# Altium project MiniPC.PrjPcb (part 1 of 2)
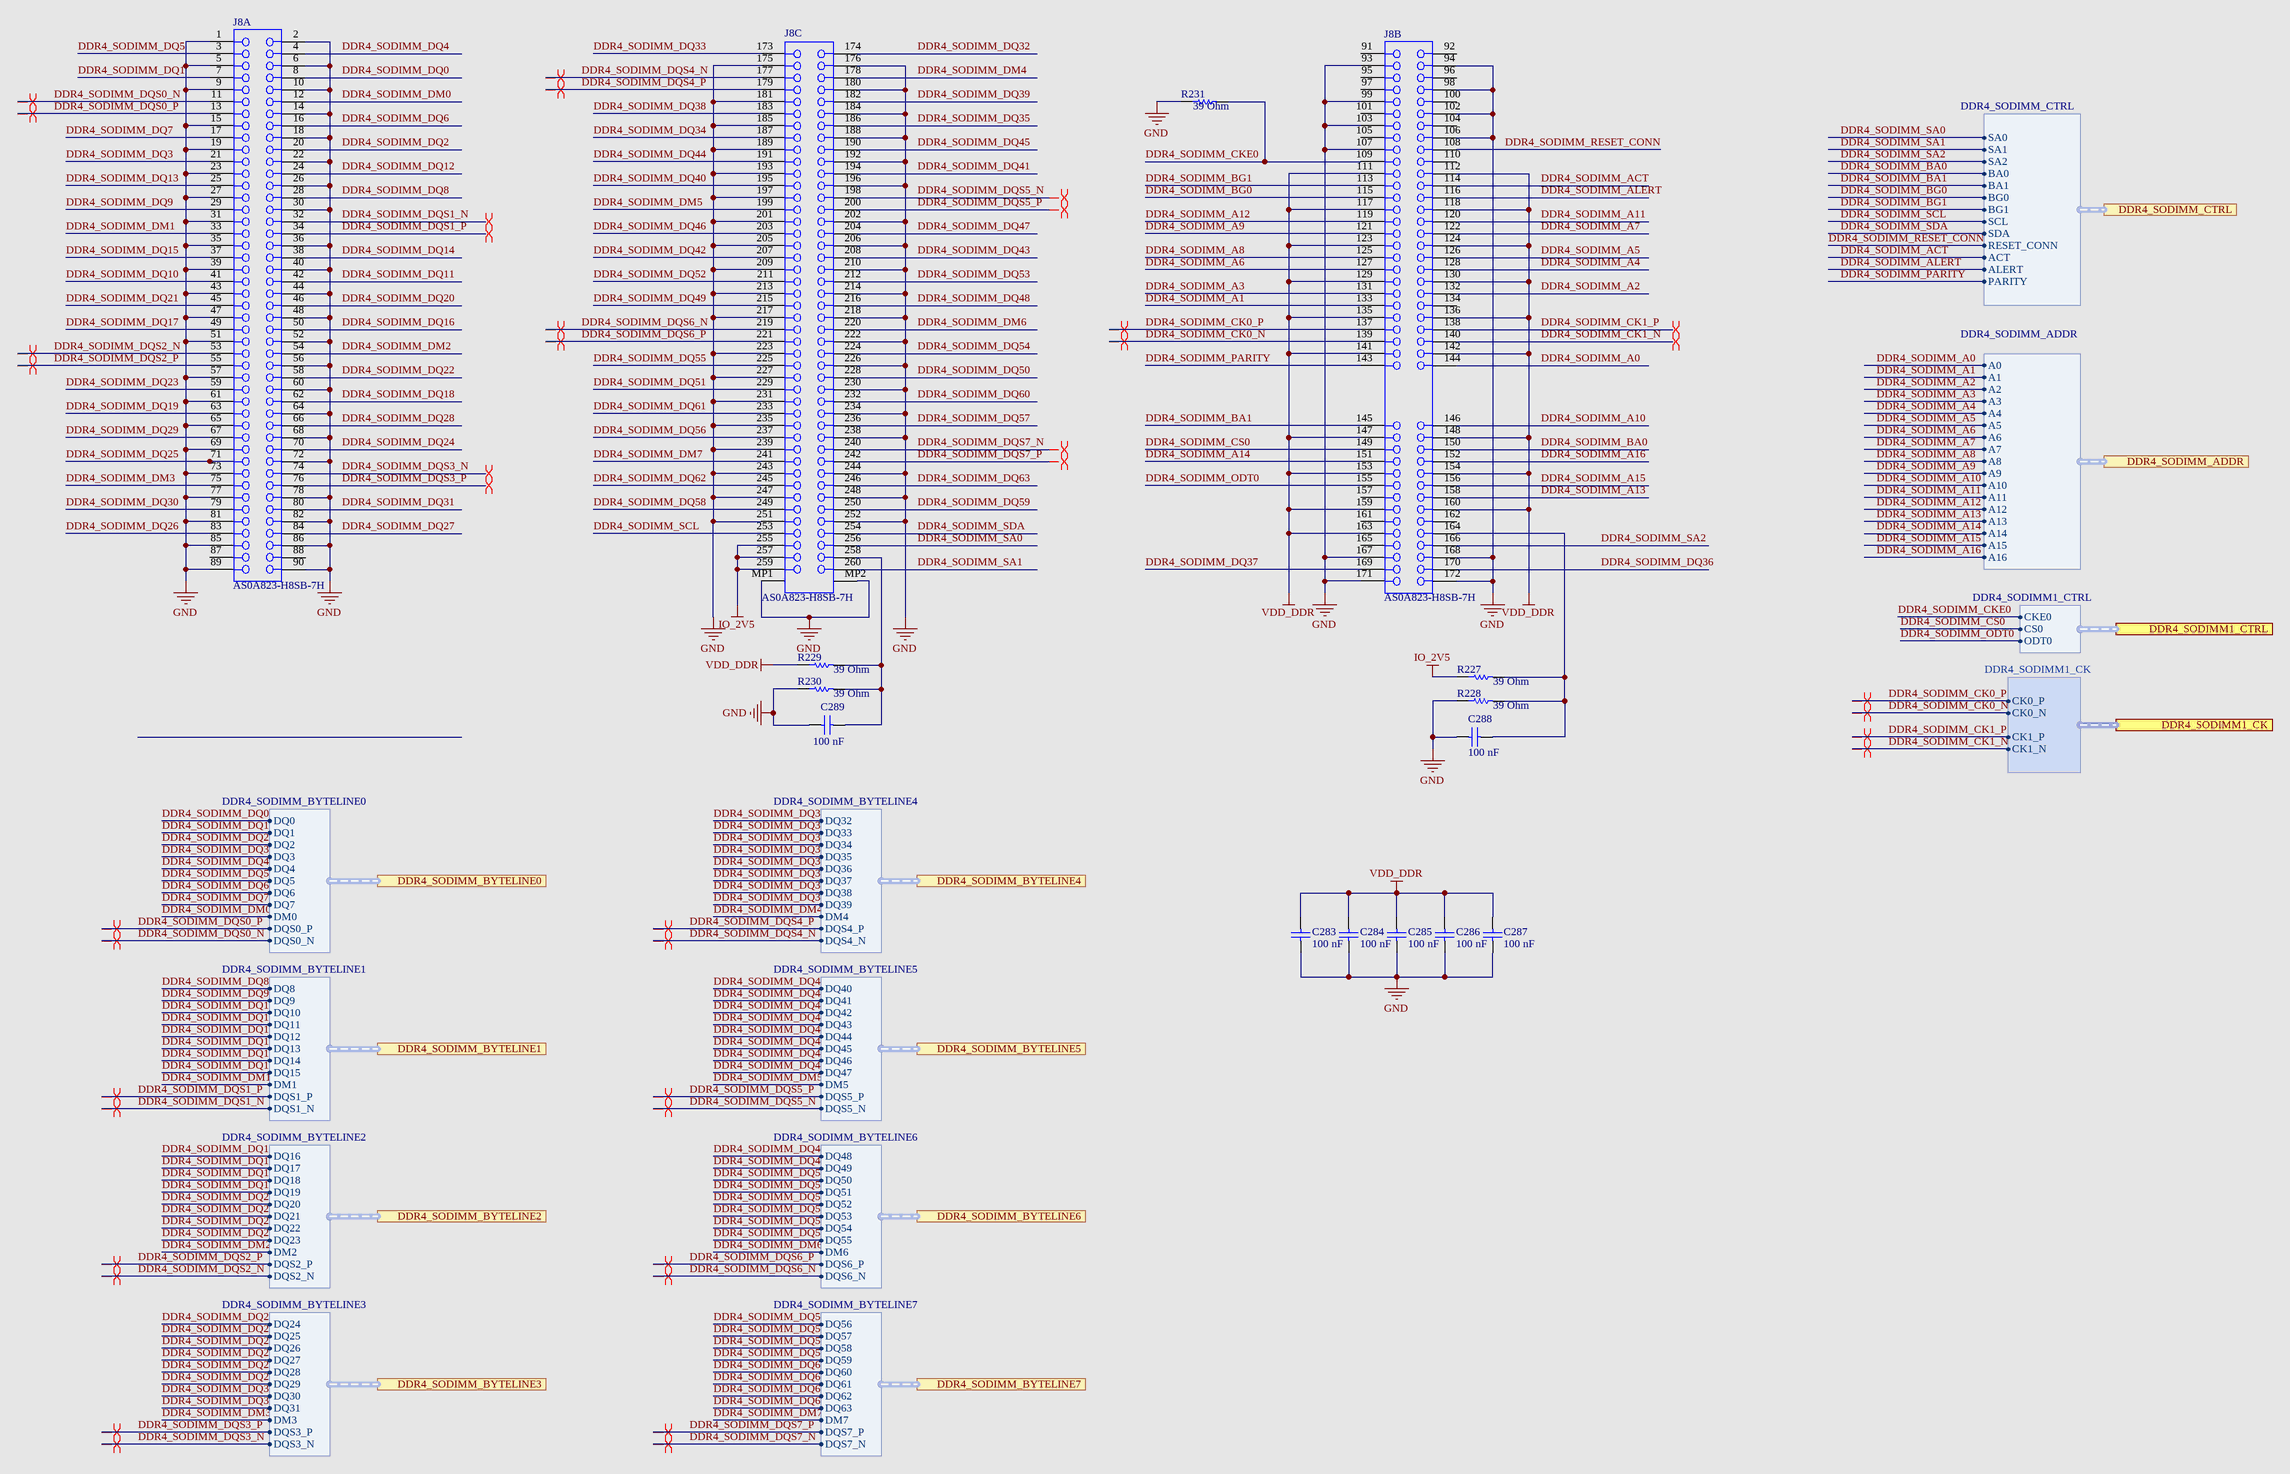
[diagram p0: DDR4_SODIMM1.SchDoc]
CompanyWebsite: www.altium.com; PrjAddress1: 4225 Executive Sqr; PrjAddress2: Suite 700; PrjAddress3: La Jolla, CA, USA; PrjAddress4: 92037; PrjCompanyName: Altium; Project: Mini PC Motherboard
4 sheets, 109 parts. Net scope: hierarchical (ports join the sheet entries above them; power ports are global).
Board file: MiniPC.PcbDoc
Sheets:
  DDR4_SODIMM1.SchDoc
  DDR4_SODIMM2.SchDoc
  Display_Port.SchDoc
  Ethernet2.SchDoc

## Sheet DDR4_SODIMM1.SchDoc: DDR4 SODIMM CONNECTOR1
size C; DocumentNumber: 3; SheetNumber: 3; SheetTotal: 46

### Parts
C283  Capacitance: 100 nF  [CAPC1005X55X10LL05]  (hidden comment: C1005X7R1E104M)
C284  Capacitance: 100 nF  [CAPC1005X55X10LL05]  (hidden comment: C1005X7R1E104M)
C285  Capacitance: 100 nF  [CAPC1005X55X10LL05]  (hidden comment: C1005X7R1E104M)
C286  Capacitance: 100 nF  [CAPC1005X55X10LL05]  (hidden comment: C1005X7R1E104M)
C287  Capacitance: 100 nF  [CAPC1005X55X10LL05]  (hidden comment: C1005X7R1E104M)
C288  Capacitance: 100 nF  [CAPC1005X55X10LL05]  (hidden comment: C1005X7R1E104M)
C289  Capacitance: 100 nF  [CAPC1005X55X10LL05]  (hidden comment: C1005X7R1E104M)
J8  AS0A823-H8SB-7H  [FOXC-AS0A823-H8SB-7H_V]  (parts A,B,C of 3)
R227  Resistance: 39 Ohm  [RESC1005X40X25NL5T10]  (hidden comment: RC0402JR-0739RL)
R228  Resistance: 39 Ohm  [RESC1005X40X25NL5T10]  (hidden comment: RC0402JR-0739RL)
R229  Resistance: 39 Ohm  [RESC1005X40X25NL5T10]  (hidden comment: RC0402JR-0739RL)
R230  Resistance: 39 Ohm  [RESC1005X40X25NL5T10]  (hidden comment: RC0402JR-0739RL)
R231  Resistance: 39 Ohm  [RESC1005X40X25NL5T10]  (hidden comment: RC0402JR-0739RL)

### Ports
DDR4_SODIMM1_CK (harness DDR4_SODIMM1_CK), DDR4_SODIMM1_CTRL (harness DDR4_SODIMM1_CTRL), DDR4_SODIMM_ADDR (harness DDR4_SODIMM_ADDR), DDR4_SODIMM_BYTELINE0 (harness DDR4_SODIMM_BYTELINE0), DDR4_SODIMM_BYTELINE1 (harness DDR4_SODIMM_BYTELINE1), DDR4_SODIMM_BYTELINE2 (harness DDR4_SODIMM_BYTELINE2), DDR4_SODIMM_BYTELINE3 (harness DDR4_SODIMM_BYTELINE3), DDR4_SODIMM_BYTELINE4 (harness DDR4_SODIMM_BYTELINE4), DDR4_SODIMM_BYTELINE5 (harness DDR4_SODIMM_BYTELINE5), DDR4_SODIMM_BYTELINE6 (harness DDR4_SODIMM_BYTELINE6), DDR4_SODIMM_BYTELINE7 (harness DDR4_SODIMM_BYTELINE7), DDR4_SODIMM_CTRL (harness DDR4_SODIMM_CTRL)

### Harnesses
DDR4_SODIMM_BYTELINE0: DQ0, DQ1, DQ2, DQ3, DQ4, DQ5, DQ6, DQ7, DM0, DQS0_P, DQS0_N
DDR4_SODIMM_BYTELINE1: DQ8, DQ9, DQ10, DQ11, DQ12, DQ13, DQ14, DQ15, DM1, DQS1_P, DQS1_N
DDR4_SODIMM_BYTELINE2: DQ16, DQ17, DQ18, DQ19, DQ20, DQ21, DQ22, DQ23, DM2, DQS2_P, DQS2_N
DDR4_SODIMM_BYTELINE3: DQ24, DQ25, DQ26, DQ27, DQ28, DQ29, DQ30, DQ31, DM3, DQS3_P, DQS3_N
DDR4_SODIMM_BYTELINE4: DQ32, DQ33, DQ34, DQ35, DQ36, DQ37, DQ38, DQ39, DM4, DQS4_P, DQS4_N
DDR4_SODIMM_BYTELINE5: DQ40, DQ41, DQ42, DQ43, DQ44, DQ45, DQ46, DQ47, DM5, DQS5_P, DQS5_N
DDR4_SODIMM_BYTELINE6: DQ48, DQ49, DQ50, DQ51, DQ52, DQ53, DQ54, DQ55, DM6, DQS6_P, DQS6_N
DDR4_SODIMM_BYTELINE7: DQ56, DQ57, DQ58, DQ59, DQ60, DQ61, DQ62, DQ63, DM7, DQS7_P, DQS7_N
DDR4_SODIMM_CTRL: SA0, SA1, SA2, BA0, BA1, BG0, BG1, SCL, SDA, RESET_CONN, ACT, ALERT, PARITY
DDR4_SODIMM1_CTRL: CKE0, CS0, ODT0
DDR4_SODIMM_ADDR: A0, A2, A1, A3, A4, A5, A6, A7, A9, A8, A10, A11, A12, A13, A14, A15, A16
DDR4_SODIMM1_CK: CK0_P, CK0_N, CK1_P, CK1_N

### Nets
GND: C283.1 C283.2 C284.1 C284.2 C285.1 C285.2 C286.1 C286.2 C287.1 C287.2 C288.1 C289.2 J8.1 J8.2 J8.5 J8.6 J8.9 J8.10 J8.14 J8.15 J8.18 J8.19 J8.22 J8.23 J8.26 J8.27 J8.30 J8.31 J8.35 J8.36 J8.39 J8.40 J8.43 J8.44 J8.47 J8.48 J8.51 J8.52 J8.56 J8.57 J8.60 J8.61 J8.64 J8.65 J8.68 J8.69 J8.72 J8.73 J8.77 J8.78 J8.81 J8.82 J8.85 J8.86 J8.89 J8.90 J8.93 J8.94 J8.98 J8.99 J8.102 J8.103 J8.106 J8.107 J8.111 J8.112 J8.117 J8.118 J8.123 J8.124 J8.129 J8.130 J8.135 J8.136 J8.141 J8.142 J8.147 J8.148 J8.153 J8.154 J8.159 J8.160 J8.163 J8.167 J8.168 J8.171 J8.172 J8.175 J8.176 J8.180 J8.181 J8.184 J8.185 J8.188 J8.189 J8.192 J8.193 J8.196 J8.197 J8.201 J8.202 J8.205 J8.206 J8.209 J8.210 J8.213 J8.214 J8.217 J8.218 J8.222 J8.223 J8.226 J8.227 J8.230 J8.231 J8.234 J8.235 J8.238 J8.239 J8.243 J8.244 J8.247 J8.248 J8.251 J8.252 J8.MP1 J8.MP2 R228.1 R229.1 R230.1 R231.1  [also labelled VDD_DDR]
IO_2V5: J8.255 J8.257 J8.259 R227.1
DDR4_SODIMM_A0: J8.144 ; port DDR4_SODIMM_ADDR.A0
DDR4_SODIMM_A1: J8.133 ; port DDR4_SODIMM_ADDR.A1
DDR4_SODIMM_A2: J8.132 ; port DDR4_SODIMM_ADDR.A2
DDR4_SODIMM_A3: J8.131 ; port DDR4_SODIMM_ADDR.A3
DDR4_SODIMM_A4: J8.128 ; port DDR4_SODIMM_ADDR.A4
DDR4_SODIMM_A5: J8.126 ; port DDR4_SODIMM_ADDR.A5
DDR4_SODIMM_A6: J8.127 ; port DDR4_SODIMM_ADDR.A6
DDR4_SODIMM_A7: J8.122 ; port DDR4_SODIMM_ADDR.A7
DDR4_SODIMM_A8: J8.125 ; port DDR4_SODIMM_ADDR.A8
DDR4_SODIMM_A9: J8.121 ; port DDR4_SODIMM_ADDR.A9
DDR4_SODIMM_A10: J8.146 ; port DDR4_SODIMM_ADDR.A10
DDR4_SODIMM_A11: J8.120 ; port DDR4_SODIMM_ADDR.A11
DDR4_SODIMM_A12: J8.119 ; port DDR4_SODIMM_ADDR.A12
DDR4_SODIMM_A13: J8.158 ; port DDR4_SODIMM_ADDR.A13
DDR4_SODIMM_A14: J8.151 ; port DDR4_SODIMM_ADDR.A14
DDR4_SODIMM_A15: J8.156 ; port DDR4_SODIMM_ADDR.A15
DDR4_SODIMM_A16: J8.152 ; port DDR4_SODIMM_ADDR.A16
DDR4_SODIMM_ACT: J8.114 ; port DDR4_SODIMM_CTRL.ACT
DDR4_SODIMM_ALERT: J8.116 ; port DDR4_SODIMM_CTRL.ALERT
DDR4_SODIMM_BA0: J8.150 ; port DDR4_SODIMM_CTRL.BA0
DDR4_SODIMM_BA1: J8.145 ; port DDR4_SODIMM_CTRL.BA1
DDR4_SODIMM_BG0: J8.115 ; port DDR4_SODIMM_CTRL.BG0
DDR4_SODIMM_BG1: J8.113 ; port DDR4_SODIMM_CTRL.BG1
DDR4_SODIMM_CK0_N: J8.139 ; port DDR4_SODIMM1_CK.CK0_N
DDR4_SODIMM_CK0_P: J8.137 ; port DDR4_SODIMM1_CK.CK0_P
DDR4_SODIMM_CK1_N: J8.140 ; port DDR4_SODIMM1_CK.CK1_N
DDR4_SODIMM_CK1_P: J8.138 ; port DDR4_SODIMM1_CK.CK1_P
DDR4_SODIMM_CKE0: J8.109 R231.2 ; port DDR4_SODIMM1_CTRL.CKE0
DDR4_SODIMM_CS0: J8.149 ; port DDR4_SODIMM1_CTRL.CS0
DDR4_SODIMM_DM0: J8.12 ; port DDR4_SODIMM_BYTELINE0.DM0
DDR4_SODIMM_DM1: J8.33 ; port DDR4_SODIMM_BYTELINE1.DM1
DDR4_SODIMM_DM2: J8.54 ; port DDR4_SODIMM_BYTELINE2.DM2
DDR4_SODIMM_DM3: J8.75 ; port DDR4_SODIMM_BYTELINE3.DM3
DDR4_SODIMM_DM4: J8.178 ; port DDR4_SODIMM_BYTELINE4.DM4
DDR4_SODIMM_DM5: J8.199 ; port DDR4_SODIMM_BYTELINE5.DM5
DDR4_SODIMM_DM6: J8.220 ; port DDR4_SODIMM_BYTELINE6.DM6
DDR4_SODIMM_DM7: J8.241 ; port DDR4_SODIMM_BYTELINE7.DM7
DDR4_SODIMM_DQ0: J8.8 ; port DDR4_SODIMM_BYTELINE0.DQ0
DDR4_SODIMM_DQ1: J8.7 ; port DDR4_SODIMM_BYTELINE0.DQ1
DDR4_SODIMM_DQ2: J8.20 ; port DDR4_SODIMM_BYTELINE0.DQ2
DDR4_SODIMM_DQ3: J8.21 ; port DDR4_SODIMM_BYTELINE0.DQ3
DDR4_SODIMM_DQ4: J8.4 ; port DDR4_SODIMM_BYTELINE0.DQ4
DDR4_SODIMM_DQ5: J8.3 ; port DDR4_SODIMM_BYTELINE0.DQ5
DDR4_SODIMM_DQ6: J8.16 ; port DDR4_SODIMM_BYTELINE0.DQ6
DDR4_SODIMM_DQ7: J8.17 ; port DDR4_SODIMM_BYTELINE0.DQ7
DDR4_SODIMM_DQ8: J8.28 ; port DDR4_SODIMM_BYTELINE1.DQ8
DDR4_SODIMM_DQ9: J8.29 ; port DDR4_SODIMM_BYTELINE1.DQ9
DDR4_SODIMM_DQ10: J8.41 ; port DDR4_SODIMM_BYTELINE1.DQ10
DDR4_SODIMM_DQ11: J8.42 ; port DDR4_SODIMM_BYTELINE1.DQ11
DDR4_SODIMM_DQ12: J8.24 ; port DDR4_SODIMM_BYTELINE1.DQ12
DDR4_SODIMM_DQ13: J8.25 ; port DDR4_SODIMM_BYTELINE1.DQ13
DDR4_SODIMM_DQ14: J8.38 ; port DDR4_SODIMM_BYTELINE1.DQ14
DDR4_SODIMM_DQ15: J8.37 ; port DDR4_SODIMM_BYTELINE1.DQ15
DDR4_SODIMM_DQ16: J8.50 ; port DDR4_SODIMM_BYTELINE2.DQ16
DDR4_SODIMM_DQ17: J8.49 ; port DDR4_SODIMM_BYTELINE2.DQ17
DDR4_SODIMM_DQ18: J8.62 ; port DDR4_SODIMM_BYTELINE2.DQ18
DDR4_SODIMM_DQ19: J8.63 ; port DDR4_SODIMM_BYTELINE2.DQ19
DDR4_SODIMM_DQ20: J8.46 ; port DDR4_SODIMM_BYTELINE2.DQ20
DDR4_SODIMM_DQ21: J8.45 ; port DDR4_SODIMM_BYTELINE2.DQ21
DDR4_SODIMM_DQ22: J8.58 ; port DDR4_SODIMM_BYTELINE2.DQ22
DDR4_SODIMM_DQ23: J8.59 ; port DDR4_SODIMM_BYTELINE2.DQ23
DDR4_SODIMM_DQ24: J8.70 ; port DDR4_SODIMM_BYTELINE3.DQ24
DDR4_SODIMM_DQ25: J8.71 ; port DDR4_SODIMM_BYTELINE3.DQ25
DDR4_SODIMM_DQ26: J8.83 ; port DDR4_SODIMM_BYTELINE3.DQ26
DDR4_SODIMM_DQ27: J8.84 ; port DDR4_SODIMM_BYTELINE3.DQ27
DDR4_SODIMM_DQ28: J8.66 ; port DDR4_SODIMM_BYTELINE3.DQ28
DDR4_SODIMM_DQ29: J8.67 ; port DDR4_SODIMM_BYTELINE3.DQ29
DDR4_SODIMM_DQ30: J8.79 ; port DDR4_SODIMM_BYTELINE3.DQ30
DDR4_SODIMM_DQ31: J8.80 ; port DDR4_SODIMM_BYTELINE3.DQ31
DDR4_SODIMM_DQ32: J8.174 ; port DDR4_SODIMM_BYTELINE4.DQ32
DDR4_SODIMM_DQ33: J8.173 ; port DDR4_SODIMM_BYTELINE4.DQ33
DDR4_SODIMM_DQ34: J8.187 ; port DDR4_SODIMM_BYTELINE4.DQ34
DDR4_SODIMM_DQ35: J8.186 ; port DDR4_SODIMM_BYTELINE4.DQ35
DDR4_SODIMM_DQ36: J8.170 ; port DDR4_SODIMM_BYTELINE4.DQ36
DDR4_SODIMM_DQ37: J8.169 ; port DDR4_SODIMM_BYTELINE4.DQ37
DDR4_SODIMM_DQ38: J8.183 ; port DDR4_SODIMM_BYTELINE4.DQ38
DDR4_SODIMM_DQ39: J8.182 ; port DDR4_SODIMM_BYTELINE4.DQ39
DDR4_SODIMM_DQ40: J8.195 ; port DDR4_SODIMM_BYTELINE5.DQ40
DDR4_SODIMM_DQ41: J8.194 ; port DDR4_SODIMM_BYTELINE5.DQ41
DDR4_SODIMM_DQ42: J8.207 ; port DDR4_SODIMM_BYTELINE5.DQ42
DDR4_SODIMM_DQ43: J8.208 ; port DDR4_SODIMM_BYTELINE5.DQ43
DDR4_SODIMM_DQ44: J8.191 ; port DDR4_SODIMM_BYTELINE5.DQ44
DDR4_SODIMM_DQ45: J8.190 ; port DDR4_SODIMM_BYTELINE5.DQ45
DDR4_SODIMM_DQ46: J8.203 ; port DDR4_SODIMM_BYTELINE5.DQ46
DDR4_SODIMM_DQ47: J8.204 ; port DDR4_SODIMM_BYTELINE5.DQ47
DDR4_SODIMM_DQ48: J8.216 ; port DDR4_SODIMM_BYTELINE6.DQ48
DDR4_SODIMM_DQ49: J8.215 ; port DDR4_SODIMM_BYTELINE6.DQ49
DDR4_SODIMM_DQ50: J8.228 ; port DDR4_SODIMM_BYTELINE6.DQ50
DDR4_SODIMM_DQ51: J8.229 ; port DDR4_SODIMM_BYTELINE6.DQ51
DDR4_SODIMM_DQ52: J8.211 ; port DDR4_SODIMM_BYTELINE6.DQ52
DDR4_SODIMM_DQ53: J8.212 ; port DDR4_SODIMM_BYTELINE6.DQ53
DDR4_SODIMM_DQ54: J8.224 ; port DDR4_SODIMM_BYTELINE6.DQ54
DDR4_SODIMM_DQ55: J8.225 ; port DDR4_SODIMM_BYTELINE6.DQ55
DDR4_SODIMM_DQ56: J8.237 ; port DDR4_SODIMM_BYTELINE7.DQ56
DDR4_SODIMM_DQ57: J8.236 ; port DDR4_SODIMM_BYTELINE7.DQ57
DDR4_SODIMM_DQ58: J8.249 ; port DDR4_SODIMM_BYTELINE7.DQ58
DDR4_SODIMM_DQ59: J8.250 ; port DDR4_SODIMM_BYTELINE7.DQ59
DDR4_SODIMM_DQ60: J8.232 ; port DDR4_SODIMM_BYTELINE7.DQ60
DDR4_SODIMM_DQ61: J8.233 ; port DDR4_SODIMM_BYTELINE7.DQ61
DDR4_SODIMM_DQ62: J8.245 ; port DDR4_SODIMM_BYTELINE7.DQ62
DDR4_SODIMM_DQ63: J8.246 ; port DDR4_SODIMM_BYTELINE7.DQ63
DDR4_SODIMM_DQS0_N: J8.11 ; port DDR4_SODIMM_BYTELINE0.DQS0_N
DDR4_SODIMM_DQS0_P: J8.13 ; port DDR4_SODIMM_BYTELINE0.DQS0_P
DDR4_SODIMM_DQS1_N: J8.32 ; port DDR4_SODIMM_BYTELINE1.DQS1_N
DDR4_SODIMM_DQS1_P: J8.34 ; port DDR4_SODIMM_BYTELINE1.DQS1_P
DDR4_SODIMM_DQS2_N: J8.53 ; port DDR4_SODIMM_BYTELINE2.DQS2_N
DDR4_SODIMM_DQS2_P: J8.55 ; port DDR4_SODIMM_BYTELINE2.DQS2_P
DDR4_SODIMM_DQS3_N: J8.74 ; port DDR4_SODIMM_BYTELINE3.DQS3_N
DDR4_SODIMM_DQS3_P: J8.76 ; port DDR4_SODIMM_BYTELINE3.DQS3_P
DDR4_SODIMM_DQS4_N: J8.177 ; port DDR4_SODIMM_BYTELINE4.DQS4_N
DDR4_SODIMM_DQS4_P: J8.179 ; port DDR4_SODIMM_BYTELINE4.DQS4_P
DDR4_SODIMM_DQS5_N: J8.198 ; port DDR4_SODIMM_BYTELINE5.DQS5_N
DDR4_SODIMM_DQS5_P: J8.200 ; port DDR4_SODIMM_BYTELINE5.DQS5_P
DDR4_SODIMM_DQS6_N: J8.219 ; port DDR4_SODIMM_BYTELINE6.DQS6_N
DDR4_SODIMM_DQS6_P: J8.221 ; port DDR4_SODIMM_BYTELINE6.DQS6_P
DDR4_SODIMM_DQS7_N: J8.240 ; port DDR4_SODIMM_BYTELINE7.DQS7_N
DDR4_SODIMM_DQS7_P: J8.242 ; port DDR4_SODIMM_BYTELINE7.DQS7_P
DDR4_SODIMM_ODT0: J8.155 ; port DDR4_SODIMM1_CTRL.ODT0
DDR4_SODIMM_PARITY: J8.143 ; port DDR4_SODIMM_CTRL.PARITY
DDR4_SODIMM_RESET_CONN: J8.108 ; port DDR4_SODIMM_CTRL.RESET_CONN
DDR4_SODIMM_SA0: J8.256 ; port DDR4_SODIMM_CTRL.SA0
DDR4_SODIMM_SA1: J8.260 ; port DDR4_SODIMM_CTRL.SA1
DDR4_SODIMM_SA2: J8.166 ; port DDR4_SODIMM_CTRL.SA2
DDR4_SODIMM_SCL: J8.253 ; port DDR4_SODIMM_CTRL.SCL
DDR4_SODIMM_SDA: J8.254 ; port DDR4_SODIMM_CTRL.SDA
NetC288_2: C288.2 J8.164 R227.2 R228.2
NetC289_1: C289.1 J8.258 R229.2 R230.2

Not connected (* = marked no-connect by the designer): J8 87 88 91 92 95 96 97 100 101 104 105 110 134 157 161 162 165

### Layout directives
differential pair: DDR4_SODIMM_CK0_N, DDR4_SODIMM_CK0_P, DDR4_SODIMM_CK1_N, DDR4_SODIMM_CK1_P, DDR4_SODIMM_DQS0_N, DDR4_SODIMM_DQS0_P, DDR4_SODIMM_DQS1_N, DDR4_SODIMM_DQS1_P, DDR4_SODIMM_DQS2_N, DDR4_SODIMM_DQS2_P, DDR4_SODIMM_DQS3_N, DDR4_SODIMM_DQS3_P, DDR4_SODIMM_DQS4_N, DDR4_SODIMM_DQS4_P, DDR4_SODIMM_DQS5_N, DDR4_SODIMM_DQS5_P, DDR4_SODIMM_DQS6_N, DDR4_SODIMM_DQS6_P, DDR4_SODIMM_DQS7_N, DDR4_SODIMM_DQS7_P

### Notes on the sheet
- Title
- Size:
- Date:
- File:
- B
- Number:
- Time:
- Revision:
- Sheet
- of

### Library data of the parts
C283-C289 = CMP-1663-00009-2: Chip Capacitor, 0.1 uF, +/- 20%, 25 V, -55 to 125 degC, 0402 (1005 Metric), RoHS, Tape and Reel; Type (Capacitors): X7R; Voltage Rating: 25 V; Case\/Package: 0402; Tolerance: 20%; Mounting Technology: Surface Mount; Max Operating Temperature: 125 degC; ComponentLink2URL: http://www.farnell.com/datasheets/1571323.pdf; ComponentLink1URL: http://www.tdk.com/; RoHSCompliant: true; Packaging: Tape and Reel; ComponentLink2Description: Datasheet; Case Code (Imperial): 0402; DatasheetVersion: 09/2011; ComponentLink1Description: Manufacturer URL; PackageDescription: 2-Pin Surface Mount Device, Body 1 x 0.5 mm; PackageReference: 0402; Min Operating Temperature: -55 degC; Case Code (Metric): 1005; Height: 0.5 mm; Package Quantity: 10000; Width: 0.5 mm; Pins: 2; Voltage Rating (DC): 25 V; PartNumber: C1005X7R1E104M; Mount: Surface Mount; Length: 1 mm
J8 = CMP-1735-00002-1: Surface Mount Horizontal Type DDR4 DIMM Socket Connector, 260 Position, Pitch 0.5 mm, -55 to 85 degC, Halogen/Lead Free, Tape and Reel; Mounting Technology: Surface Mount; ComponentLink1URL: http://www.foxconn.com/; ComponentLink2URL: https://drive.google.com/drive/folders/0By4GUdJb-DJ9Um5lRWw4YjB4d2c; PackageDescription: 260-Pin Surface Mount Device, Body Length 73.1 mm, Pitch 0.5 mm; PartNumber: AS0A823-H8SB-7H; DatasheetVersion: Rev. A, 10/2013; ComponentLink1Description: Manufacturer URL; ComponentLink2Description: Surface Mount; System: Connector
R227-R231 = CMP-2002-07994-2: Chip Resistor, 39 Ohm, +/- 5%, 0.063 W, -55 to 155 degC, 0402 (1005 Metric), RoHS, Tape and Reel; Power Rating: 63 mW; Voltage Rating (DC): 50 V; Case Code (Imperial): 0402; Mount: Surface Mount; Max Operating Temperature: 155 degC; Case Code (Metric): 1005; ComponentLink1Description: Manufacturer URL; PackageDescription: 2-Pin Surface Mount Device, Body 1 x 0.5 mm; PartNumber: RC0402JR-0739RL; ComponentLink2Description: Datasheet; Tolerance: 5%; Height: 0.35 mm; Pins: 2; Min Operating Temperature: -55 degC; Length: 1 mm; DatasheetVersion: Rev. 4, 02/2016; ComponentLink2URL: http://www.yageo.com/documents/recent/PYu-RC_Group_51_RoHS_L_04.pdf; Mounting Technology: Surface Mount; Packaging: Cut Tape; Case/Package: 0402; Package Quantity: 1; RoHSCompliant: true; REACH SVHC: No SVHC; Width: 0.5 mm; Voltage Rating: 50 V; ComponentLink1URL: http://www.yageo.com/

## Sheet DDR4_SODIMM2.SchDoc: DDR4 SODIMM CONNECTOR1
size C; DocumentNumber: 4; SheetNumber: 4; SheetTotal: 46
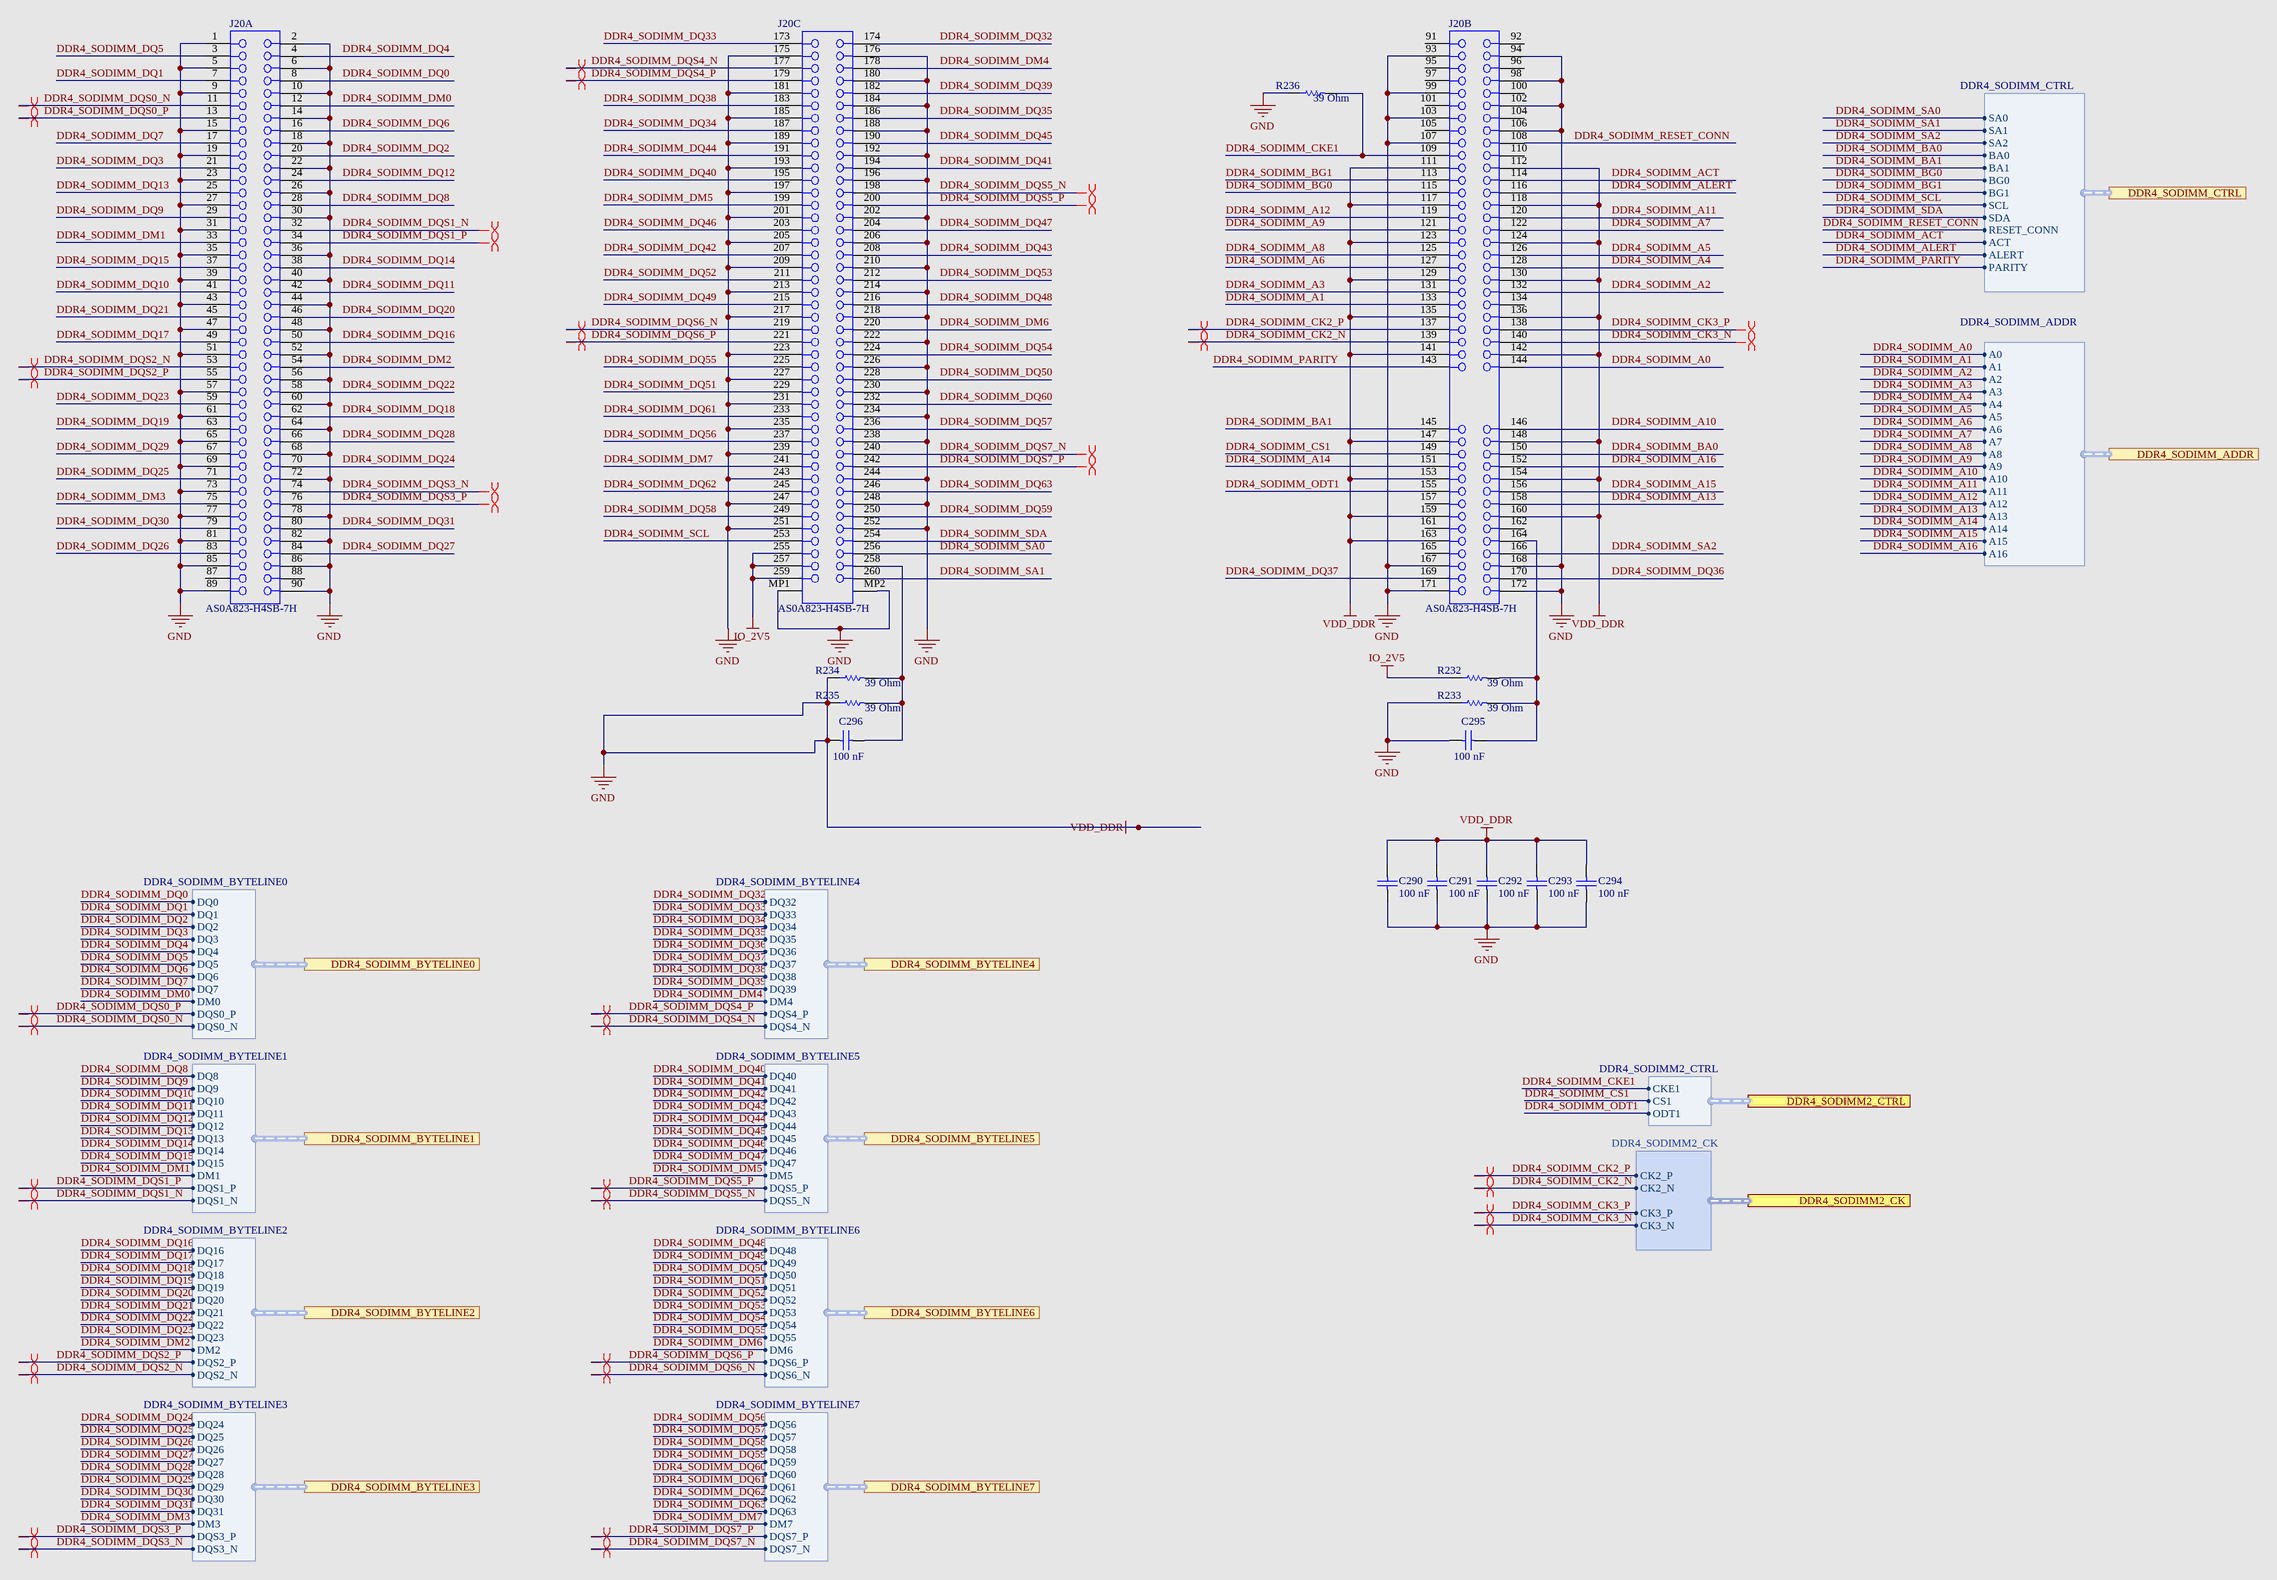
[diagram p1: DDR4_SODIMM2.SchDoc]

### Parts
C290  Capacitance: 100 nF  [CAPC1005X55X10LL05]  (hidden comment: C1005X7R1E104M)
C291  Capacitance: 100 nF  [CAPC1005X55X10LL05]  (hidden comment: C1005X7R1E104M)
C292  Capacitance: 100 nF  [CAPC1005X55X10LL05]  (hidden comment: C1005X7R1E104M)
C293  Capacitance: 100 nF  [CAPC1005X55X10LL05]  (hidden comment: C1005X7R1E104M)
C294  Capacitance: 100 nF  [CAPC1005X55X10LL05]  (hidden comment: C1005X7R1E104M)
C295  Capacitance: 100 nF  [CAPC1005X55X10LL05]  (hidden comment: C1005X7R1E104M)
C296  Capacitance: 100 nF  [CAPC1005X55X10LL05]  (hidden comment: C1005X7R1E104M)
J20  AS0A823-H4SB-7H  [FOXC-AS0A823-H4SB-7H_V]  (parts A,B,C of 3)
R232  Resistance: 39 Ohm  [RESC1005X35X25NL8T10]  (hidden comment: NRC04F49R9TRF)
R233  Resistance: 39 Ohm  [RESC1005X35X25NL8T10]  (hidden comment: NRC04F49R9TRF)
R234  Resistance: 39 Ohm  [RESC1005X35X25NL8T10]  (hidden comment: NRC04F49R9TRF)
R235  Resistance: 39 Ohm  [RESC1005X35X25NL8T10]  (hidden comment: NRC04F49R9TRF)
R236  Resistance: 39 Ohm  [RESC1005X40X25NL5T10]  (hidden comment: RC0402JR-0739RL)

### Ports
DDR4_SODIMM2_CK (harness DDR4_SODIMM2_CK), DDR4_SODIMM2_CTRL (harness DDR4_SODIMM2_CTRL), DDR4_SODIMM_ADDR (harness DDR4_SODIMM_ADDR), DDR4_SODIMM_BYTELINE0 (harness DDR4_SODIMM_BYTELINE0), DDR4_SODIMM_BYTELINE1 (harness DDR4_SODIMM_BYTELINE1), DDR4_SODIMM_BYTELINE2 (harness DDR4_SODIMM_BYTELINE2), DDR4_SODIMM_BYTELINE3 (harness DDR4_SODIMM_BYTELINE3), DDR4_SODIMM_BYTELINE4 (harness DDR4_SODIMM_BYTELINE4), DDR4_SODIMM_BYTELINE5 (harness DDR4_SODIMM_BYTELINE5), DDR4_SODIMM_BYTELINE6 (harness DDR4_SODIMM_BYTELINE6), DDR4_SODIMM_BYTELINE7 (harness DDR4_SODIMM_BYTELINE7), DDR4_SODIMM_CTRL (harness DDR4_SODIMM_CTRL)

### Harnesses
DDR4_SODIMM_CTRL: SA0, SA1, SA2, BA0, BA1, BG0, BG1, SCL, SDA, RESET_CONN, ACT, ALERT, PARITY
DDR4_SODIMM_ADDR: A0, A2, A1, A3, A4, A5, A6, A7, A9, A8, A10, A11, A12, A13, A14, A15, A16
DDR4_SODIMM_BYTELINE0: DQ0, DQ1, DQ2, DQ3, DQ4, DQ5, DQ6, DQ7, DM0, DQS0_P, DQS0_N
DDR4_SODIMM_BYTELINE1: DQ8, DQ9, DQ10, DQ11, DQ12, DQ13, DQ14, DQ15, DM1, DQS1_P, DQS1_N
DDR4_SODIMM_BYTELINE2: DQ16, DQ17, DQ18, DQ19, DQ20, DQ21, DQ22, DQ23, DM2, DQS2_P, DQS2_N
DDR4_SODIMM_BYTELINE3: DQ24, DQ25, DQ26, DQ27, DQ28, DQ29, DQ30, DQ31, DM3, DQS3_P, DQS3_N
DDR4_SODIMM_BYTELINE4: DQ32, DQ33, DQ34, DQ35, DQ36, DQ37, DQ38, DQ39, DM4, DQS4_P, DQS4_N
DDR4_SODIMM_BYTELINE5: DQ40, DQ41, DQ42, DQ43, DQ44, DQ45, DQ46, DQ47, DM5, DQS5_P, DQS5_N
DDR4_SODIMM_BYTELINE6: DQ48, DQ49, DQ50, DQ51, DQ52, DQ53, DQ54, DQ55, DM6, DQS6_P, DQS6_N
DDR4_SODIMM_BYTELINE7: DQ56, DQ57, DQ58, DQ59, DQ60, DQ61, DQ62, DQ63, DM7, DQS7_P, DQS7_N
DDR4_SODIMM2_CTRL: CKE1, CS1, ODT1
DDR4_SODIMM2_CK: CK2_P, CK2_N, CK3_P, CK3_N

### Nets
GND: C290.1 C290.2 C291.1 C291.2 C292.1 C292.2 C293.1 C293.2 C294.1 C294.2 C295.2 C296.2 J20.1 J20.2 J20.5 J20.6 J20.9 J20.10 J20.14 J20.15 J20.18 J20.19 J20.22 J20.23 J20.26 J20.27 J20.30 J20.31 J20.35 J20.36 J20.39 J20.40 J20.43 J20.44 J20.47 J20.48 J20.51 J20.52 J20.56 J20.57 J20.60 J20.61 J20.64 J20.65 J20.68 J20.69 J20.72 J20.73 J20.77 J20.78 J20.81 J20.82 J20.85 J20.86 J20.89 J20.90 J20.93 J20.94 J20.98 J20.99 J20.102 J20.103 J20.106 J20.107 J20.111 J20.112 J20.117 J20.118 J20.123 J20.124 J20.129 J20.130 J20.135 J20.136 J20.141 J20.142 J20.147 J20.148 J20.153 J20.154 J20.159 J20.160 J20.163 J20.167 J20.168 J20.171 J20.172 J20.175 J20.176 J20.180 J20.181 J20.184 J20.185 J20.188 J20.189 J20.192 J20.193 J20.196 J20.197 J20.201 J20.202 J20.205 J20.206 J20.209 J20.210 J20.213 J20.214 J20.217 J20.218 J20.222 J20.223 J20.226 J20.227 J20.230 J20.231 J20.234 J20.235 J20.238 J20.239 J20.243 J20.244 J20.247 J20.248 J20.251 J20.252 J20.MP1 J20.MP2 R233.1 R234.1 R235.1 R236.1  [also labelled VDD_DDR]
IO_2V5: J20.255 J20.257 J20.259 R232.1
DDR4_SODIMM_A0: J20.144 ; port DDR4_SODIMM_ADDR.A0
DDR4_SODIMM_A1: J20.133 ; port DDR4_SODIMM_ADDR.A1
DDR4_SODIMM_A2: J20.132 ; port DDR4_SODIMM_ADDR.A2
DDR4_SODIMM_A3: J20.131 ; port DDR4_SODIMM_ADDR.A3
DDR4_SODIMM_A4: J20.128 ; port DDR4_SODIMM_ADDR.A4
DDR4_SODIMM_A5: J20.126 ; port DDR4_SODIMM_ADDR.A5
DDR4_SODIMM_A6: J20.127 ; port DDR4_SODIMM_ADDR.A6
DDR4_SODIMM_A7: J20.122 ; port DDR4_SODIMM_ADDR.A7
DDR4_SODIMM_A8: J20.125 ; port DDR4_SODIMM_ADDR.A8
DDR4_SODIMM_A9: J20.121 ; port DDR4_SODIMM_ADDR.A9
DDR4_SODIMM_A10: J20.146 ; port DDR4_SODIMM_ADDR.A10
DDR4_SODIMM_A11: J20.120 ; port DDR4_SODIMM_ADDR.A11
DDR4_SODIMM_A12: J20.119 ; port DDR4_SODIMM_ADDR.A12
DDR4_SODIMM_A13: J20.158 ; port DDR4_SODIMM_ADDR.A13
DDR4_SODIMM_A14: J20.151 ; port DDR4_SODIMM_ADDR.A14
DDR4_SODIMM_A15: J20.156 ; port DDR4_SODIMM_ADDR.A15
DDR4_SODIMM_A16: J20.152 ; port DDR4_SODIMM_ADDR.A16
DDR4_SODIMM_ACT: J20.114 ; port DDR4_SODIMM_CTRL.ACT
DDR4_SODIMM_ALERT: J20.116 ; port DDR4_SODIMM_CTRL.ALERT
DDR4_SODIMM_BA0: J20.150 ; port DDR4_SODIMM_CTRL.BA0
DDR4_SODIMM_BA1: J20.145 ; port DDR4_SODIMM_CTRL.BA1
DDR4_SODIMM_BG0: J20.115 ; port DDR4_SODIMM_CTRL.BG0
DDR4_SODIMM_BG1: J20.113 ; port DDR4_SODIMM_CTRL.BG1
DDR4_SODIMM_CK2_N: J20.139 ; port DDR4_SODIMM2_CK.CK2_N
DDR4_SODIMM_CK2_P: J20.137 ; port DDR4_SODIMM2_CK.CK2_P
DDR4_SODIMM_CK3_N: J20.140 ; port DDR4_SODIMM2_CK.CK3_N
DDR4_SODIMM_CK3_P: J20.138 ; port DDR4_SODIMM2_CK.CK3_P
DDR4_SODIMM_CKE1: J20.109 R236.2 ; port DDR4_SODIMM2_CTRL.CKE1
DDR4_SODIMM_CS1: J20.149 ; port DDR4_SODIMM2_CTRL.CS1
DDR4_SODIMM_DM0: J20.12 ; port DDR4_SODIMM_BYTELINE0.DM0
DDR4_SODIMM_DM1: J20.33 ; port DDR4_SODIMM_BYTELINE1.DM1
DDR4_SODIMM_DM2: J20.54 ; port DDR4_SODIMM_BYTELINE2.DM2
DDR4_SODIMM_DM3: J20.75 ; port DDR4_SODIMM_BYTELINE3.DM3
DDR4_SODIMM_DM4: J20.178 ; port DDR4_SODIMM_BYTELINE4.DM4
DDR4_SODIMM_DM5: J20.199 ; port DDR4_SODIMM_BYTELINE5.DM5
DDR4_SODIMM_DM6: J20.220 ; port DDR4_SODIMM_BYTELINE6.DM6
DDR4_SODIMM_DM7: J20.241 ; port DDR4_SODIMM_BYTELINE7.DM7
DDR4_SODIMM_DQ0: J20.8 ; port DDR4_SODIMM_BYTELINE0.DQ0
DDR4_SODIMM_DQ1: J20.7 ; port DDR4_SODIMM_BYTELINE0.DQ1
DDR4_SODIMM_DQ2: J20.20 ; port DDR4_SODIMM_BYTELINE0.DQ2
DDR4_SODIMM_DQ3: J20.21 ; port DDR4_SODIMM_BYTELINE0.DQ3
DDR4_SODIMM_DQ4: J20.4 ; port DDR4_SODIMM_BYTELINE0.DQ4
DDR4_SODIMM_DQ5: J20.3 ; port DDR4_SODIMM_BYTELINE0.DQ5
DDR4_SODIMM_DQ6: J20.16 ; port DDR4_SODIMM_BYTELINE0.DQ6
DDR4_SODIMM_DQ7: J20.17 ; port DDR4_SODIMM_BYTELINE0.DQ7
DDR4_SODIMM_DQ8: J20.28 ; port DDR4_SODIMM_BYTELINE1.DQ8
DDR4_SODIMM_DQ9: J20.29 ; port DDR4_SODIMM_BYTELINE1.DQ9
DDR4_SODIMM_DQ10: J20.41 ; port DDR4_SODIMM_BYTELINE1.DQ10
DDR4_SODIMM_DQ11: J20.42 ; port DDR4_SODIMM_BYTELINE1.DQ11
DDR4_SODIMM_DQ12: J20.24 ; port DDR4_SODIMM_BYTELINE1.DQ12
DDR4_SODIMM_DQ13: J20.25 ; port DDR4_SODIMM_BYTELINE1.DQ13
DDR4_SODIMM_DQ14: J20.38 ; port DDR4_SODIMM_BYTELINE1.DQ14
DDR4_SODIMM_DQ15: J20.37 ; port DDR4_SODIMM_BYTELINE1.DQ15
DDR4_SODIMM_DQ16: J20.50 ; port DDR4_SODIMM_BYTELINE2.DQ16
DDR4_SODIMM_DQ17: J20.49 ; port DDR4_SODIMM_BYTELINE2.DQ17
DDR4_SODIMM_DQ18: J20.62 ; port DDR4_SODIMM_BYTELINE2.DQ18
DDR4_SODIMM_DQ19: J20.63 ; port DDR4_SODIMM_BYTELINE2.DQ19
DDR4_SODIMM_DQ20: J20.46 ; port DDR4_SODIMM_BYTELINE2.DQ20
DDR4_SODIMM_DQ21: J20.45 ; port DDR4_SODIMM_BYTELINE2.DQ21
DDR4_SODIMM_DQ22: J20.58 ; port DDR4_SODIMM_BYTELINE2.DQ22
DDR4_SODIMM_DQ23: J20.59 ; port DDR4_SODIMM_BYTELINE2.DQ23
DDR4_SODIMM_DQ24: J20.70 ; port DDR4_SODIMM_BYTELINE3.DQ24
DDR4_SODIMM_DQ25: J20.71 ; port DDR4_SODIMM_BYTELINE3.DQ25
DDR4_SODIMM_DQ26: J20.83 ; port DDR4_SODIMM_BYTELINE3.DQ26
DDR4_SODIMM_DQ27: J20.84 ; port DDR4_SODIMM_BYTELINE3.DQ27
DDR4_SODIMM_DQ28: J20.66 ; port DDR4_SODIMM_BYTELINE3.DQ28
DDR4_SODIMM_DQ29: J20.67 ; port DDR4_SODIMM_BYTELINE3.DQ29
DDR4_SODIMM_DQ30: J20.79 ; port DDR4_SODIMM_BYTELINE3.DQ30
DDR4_SODIMM_DQ31: J20.80 ; port DDR4_SODIMM_BYTELINE3.DQ31
DDR4_SODIMM_DQ32: J20.174 ; port DDR4_SODIMM_BYTELINE4.DQ32
DDR4_SODIMM_DQ33: J20.173 ; port DDR4_SODIMM_BYTELINE4.DQ33
DDR4_SODIMM_DQ34: J20.187 ; port DDR4_SODIMM_BYTELINE4.DQ34
DDR4_SODIMM_DQ35: J20.186 ; port DDR4_SODIMM_BYTELINE4.DQ35
DDR4_SODIMM_DQ36: J20.170 ; port DDR4_SODIMM_BYTELINE4.DQ36
DDR4_SODIMM_DQ37: J20.169 ; port DDR4_SODIMM_BYTELINE4.DQ37
DDR4_SODIMM_DQ38: J20.183 ; port DDR4_SODIMM_BYTELINE4.DQ38
DDR4_SODIMM_DQ39: J20.182 ; port DDR4_SODIMM_BYTELINE4.DQ39
DDR4_SODIMM_DQ40: J20.195 ; port DDR4_SODIMM_BYTELINE5.DQ40
DDR4_SODIMM_DQ41: J20.194 ; port DDR4_SODIMM_BYTELINE5.DQ41
DDR4_SODIMM_DQ42: J20.207 ; port DDR4_SODIMM_BYTELINE5.DQ42
DDR4_SODIMM_DQ43: J20.208 ; port DDR4_SODIMM_BYTELINE5.DQ43
DDR4_SODIMM_DQ44: J20.191 ; port DDR4_SODIMM_BYTELINE5.DQ44
DDR4_SODIMM_DQ45: J20.190 ; port DDR4_SODIMM_BYTELINE5.DQ45
DDR4_SODIMM_DQ46: J20.203 ; port DDR4_SODIMM_BYTELINE5.DQ46
DDR4_SODIMM_DQ47: J20.204 ; port DDR4_SODIMM_BYTELINE5.DQ47
DDR4_SODIMM_DQ48: J20.216 ; port DDR4_SODIMM_BYTELINE6.DQ48
DDR4_SODIMM_DQ49: J20.215 ; port DDR4_SODIMM_BYTELINE6.DQ49
DDR4_SODIMM_DQ50: J20.228 ; port DDR4_SODIMM_BYTELINE6.DQ50
DDR4_SODIMM_DQ51: J20.229 ; port DDR4_SODIMM_BYTELINE6.DQ51
DDR4_SODIMM_DQ52: J20.211 ; port DDR4_SODIMM_BYTELINE6.DQ52
DDR4_SODIMM_DQ53: J20.212 ; port DDR4_SODIMM_BYTELINE6.DQ53
DDR4_SODIMM_DQ54: J20.224 ; port DDR4_SODIMM_BYTELINE6.DQ54
DDR4_SODIMM_DQ55: J20.225 ; port DDR4_SODIMM_BYTELINE6.DQ55
DDR4_SODIMM_DQ56: J20.237 ; port DDR4_SODIMM_BYTELINE7.DQ56
DDR4_SODIMM_DQ57: J20.236 ; port DDR4_SODIMM_BYTELINE7.DQ57
DDR4_SODIMM_DQ58: J20.249 ; port DDR4_SODIMM_BYTELINE7.DQ58
DDR4_SODIMM_DQ59: J20.250 ; port DDR4_SODIMM_BYTELINE7.DQ59
DDR4_SODIMM_DQ60: J20.232 ; port DDR4_SODIMM_BYTELINE7.DQ60
DDR4_SODIMM_DQ61: J20.233 ; port DDR4_SODIMM_BYTELINE7.DQ61
DDR4_SODIMM_DQ62: J20.245 ; port DDR4_SODIMM_BYTELINE7.DQ62
DDR4_SODIMM_DQ63: J20.246 ; port DDR4_SODIMM_BYTELINE7.DQ63
DDR4_SODIMM_DQS0_N: J20.11 ; port DDR4_SODIMM_BYTELINE0.DQS0_N
DDR4_SODIMM_DQS0_P: J20.13 ; port DDR4_SODIMM_BYTELINE0.DQS0_P
DDR4_SODIMM_DQS1_N: J20.32 ; port DDR4_SODIMM_BYTELINE1.DQS1_N
DDR4_SODIMM_DQS1_P: J20.34 ; port DDR4_SODIMM_BYTELINE1.DQS1_P
DDR4_SODIMM_DQS2_N: J20.53 ; port DDR4_SODIMM_BYTELINE2.DQS2_N
DDR4_SODIMM_DQS2_P: J20.55 ; port DDR4_SODIMM_BYTELINE2.DQS2_P
DDR4_SODIMM_DQS3_N: J20.74 ; port DDR4_SODIMM_BYTELINE3.DQS3_N
DDR4_SODIMM_DQS3_P: J20.76 ; port DDR4_SODIMM_BYTELINE3.DQS3_P
DDR4_SODIMM_DQS4_N: J20.177 ; port DDR4_SODIMM_BYTELINE4.DQS4_N
DDR4_SODIMM_DQS4_P: J20.179 ; port DDR4_SODIMM_BYTELINE4.DQS4_P
DDR4_SODIMM_DQS5_N: J20.198 ; port DDR4_SODIMM_BYTELINE5.DQS5_N
DDR4_SODIMM_DQS5_P: J20.200 ; port DDR4_SODIMM_BYTELINE5.DQS5_P
DDR4_SODIMM_DQS6_N: J20.219 ; port DDR4_SODIMM_BYTELINE6.DQS6_N
DDR4_SODIMM_DQS6_P: J20.221 ; port DDR4_SODIMM_BYTELINE6.DQS6_P
DDR4_SODIMM_DQS7_N: J20.240 ; port DDR4_SODIMM_BYTELINE7.DQS7_N
DDR4_SODIMM_DQS7_P: J20.242 ; port DDR4_SODIMM_BYTELINE7.DQS7_P
DDR4_SODIMM_ODT1: J20.155 ; port DDR4_SODIMM2_CTRL.ODT1
DDR4_SODIMM_PARITY: J20.143 ; port DDR4_SODIMM_CTRL.PARITY
DDR4_SODIMM_RESET_CONN: J20.108 ; port DDR4_SODIMM_CTRL.RESET_CONN
DDR4_SODIMM_SA0: J20.256 ; port DDR4_SODIMM_CTRL.SA0
DDR4_SODIMM_SA1: J20.260 ; port DDR4_SODIMM_CTRL.SA1
DDR4_SODIMM_SA2: J20.166 ; port DDR4_SODIMM_CTRL.SA2
DDR4_SODIMM_SCL: J20.253 ; port DDR4_SODIMM_CTRL.SCL
DDR4_SODIMM_SDA: J20.254 ; port DDR4_SODIMM_CTRL.SDA
NetC295_1: C295.1 J20.164 R232.2 R233.2
NetC296_1: C296.1 J20.258 R234.2 R235.2

Not connected (* = marked no-connect by the designer): J20 87 88 91 92 95 96 97 100 101 104 105 110 134 157 161 162 165

### Layout directives
differential pair: DDR4_SODIMM_CK2_N, DDR4_SODIMM_CK2_P, DDR4_SODIMM_CK3_N, DDR4_SODIMM_CK3_P, DDR4_SODIMM_DQS0_N, DDR4_SODIMM_DQS0_P, DDR4_SODIMM_DQS1_N, DDR4_SODIMM_DQS1_P, DDR4_SODIMM_DQS2_N, DDR4_SODIMM_DQS2_P, DDR4_SODIMM_DQS3_N, DDR4_SODIMM_DQS3_P, DDR4_SODIMM_DQS4_N, DDR4_SODIMM_DQS4_P, DDR4_SODIMM_DQS5_N, DDR4_SODIMM_DQS5_P, DDR4_SODIMM_DQS6_N, DDR4_SODIMM_DQS6_P, DDR4_SODIMM_DQS7_N, DDR4_SODIMM_DQS7_P

### Notes on the sheet
- Title
- Size:
- Date:
- File:
- B
- Number:
- Time:
- Revision:
- Sheet
- of

### Library data of the parts
C290-C296 = CMP-1663-00009-2: as C283 on sheet DDR4_SODIMM1; Tolerance: 20%; Mounting Technology: Surface Mount; Max Operating Temperature: 125 degC; ComponentLink2URL: http://www.farnell.com/datasheets/1571323.pdf; ComponentLink1URL: http://www.tdk.com/; RoHSCompliant: true; Packaging: Tape and Reel; ComponentLink2Description: Datasheet; Case Code (Imperial): 0402; DatasheetVersion: 09/2011; ComponentLink1Description: Manufacturer URL; PackageDescription: 2-Pin Surface Mount Device, Body 1 x 0.5 mm; PackageReference: 0402; Min Operating Temperature: -55 degC; Case Code (Metric): 1005; Height: 0.5 mm; Package Quantity: 10000; Width: 0.5 mm; Pins: 2; Voltage Rating (DC): 25 V; PartNumber: C1005X7R1E104M; Mount: Surface Mount; Length: 1 mm
J20 = CMP-1735-00001-2: Surface Mount Horizontal Type DDR4 DIMM Socket Connector, 260 Position, Pitch 0.5 mm, -55 to 85 degC, Halogen/Lead Free, Tape and Reel; Mounting Technology: Surface Mount; ComponentLink1URL: http://www.foxconn.com/; ComponentLink2URL: https://drive.google.com/drive/folders/0By4GUdJb-DJ9Um5lRWw4YjB4d2c; PackageDescription: 260-Pin Surface Mount Device, Body Length 73.1 mm, Pitch 0.5 mm; PartNumber: AS0A823-H4SB-7H; DatasheetVersion: Rev. A, 10/2013; ComponentLink1Description: Manufacturer URL; ComponentLink2Description: Datasheet; System: Connector
R232-R235 = CMP-2002-07994-2: Chip Resistor, 39 Ohm, +/- 5%, 0.063 W, -55 to 155 degC, 0402 (1005 Metric), RoHS, Tape and Reel; PartNumber: RC0402JR-0739RL; Power Rating: 63 mW; Voltage Rating (DC): 50 V; Case Code (Imperial): 0402; Mount: Surface Mount; Max Operating Temperature: 155 degC; Case Code (Metric): 1005; ComponentLink1Description: Manufacturer URL; PackageDescription: 2-Pin Surface Mount Device, Body 1 x 0.5 mm; ComponentLink2Description: Datasheet; Tolerance: 5%; Height: 0.35 mm; Pins: 2; Min Operating Temperature: -55 degC; Length: 1 mm; DatasheetVersion: Rev. 4, 02/2016; ComponentLink2URL: http://www.yageo.com/documents/recent/PYu-RC_Group_51_RoHS_L_04.pdf; Mounting Technology: Surface Mount; Packaging: Cut Tape; Case/Package: 0402; Package Quantity: 1; RoHSCompliant: true; REACH SVHC: No SVHC; Width: 0.5 mm; Voltage Rating: 50 V; ComponentLink1URL: http://www.yageo.com/
R236 = CMP-2002-07994-2: as R227 on sheet DDR4_SODIMM1; Case Code (Imperial): 0402; Mount: Surface Mount; Max Operating Temperature: 155 degC; Case Code (Metric): 1005; ComponentLink1Description: Manufacturer URL; PackageDescription: 2-Pin Surface Mount Device, Body 1 x 0.5 mm; PartNumber: RC0402JR-0739RL; ComponentLink2Description: Datasheet; Tolerance: 5%; Height: 0.35 mm; Pins: 2; Min Operating Temperature: -55 degC; Length: 1 mm; DatasheetVersion: Rev. 4, 02/2016; ComponentLink2URL: http://www.yageo.com/documents/recent/PYu-RC_Group_51_RoHS_L_04.pdf; Mounting Technology: Surface Mount; Packaging: Cut Tape; Case/Package: 0402; Package Quantity: 1; RoHSCompliant: true; REACH SVHC: No SVHC; Width: 0.5 mm; Voltage Rating: 50 V; ComponentLink1URL: http://www.yageo.com/

## Sheet Display_Port.SchDoc: Display Port (x4)
size B; DocumentNumber: 5; SheetNumber: 5; SheetTotal: 46
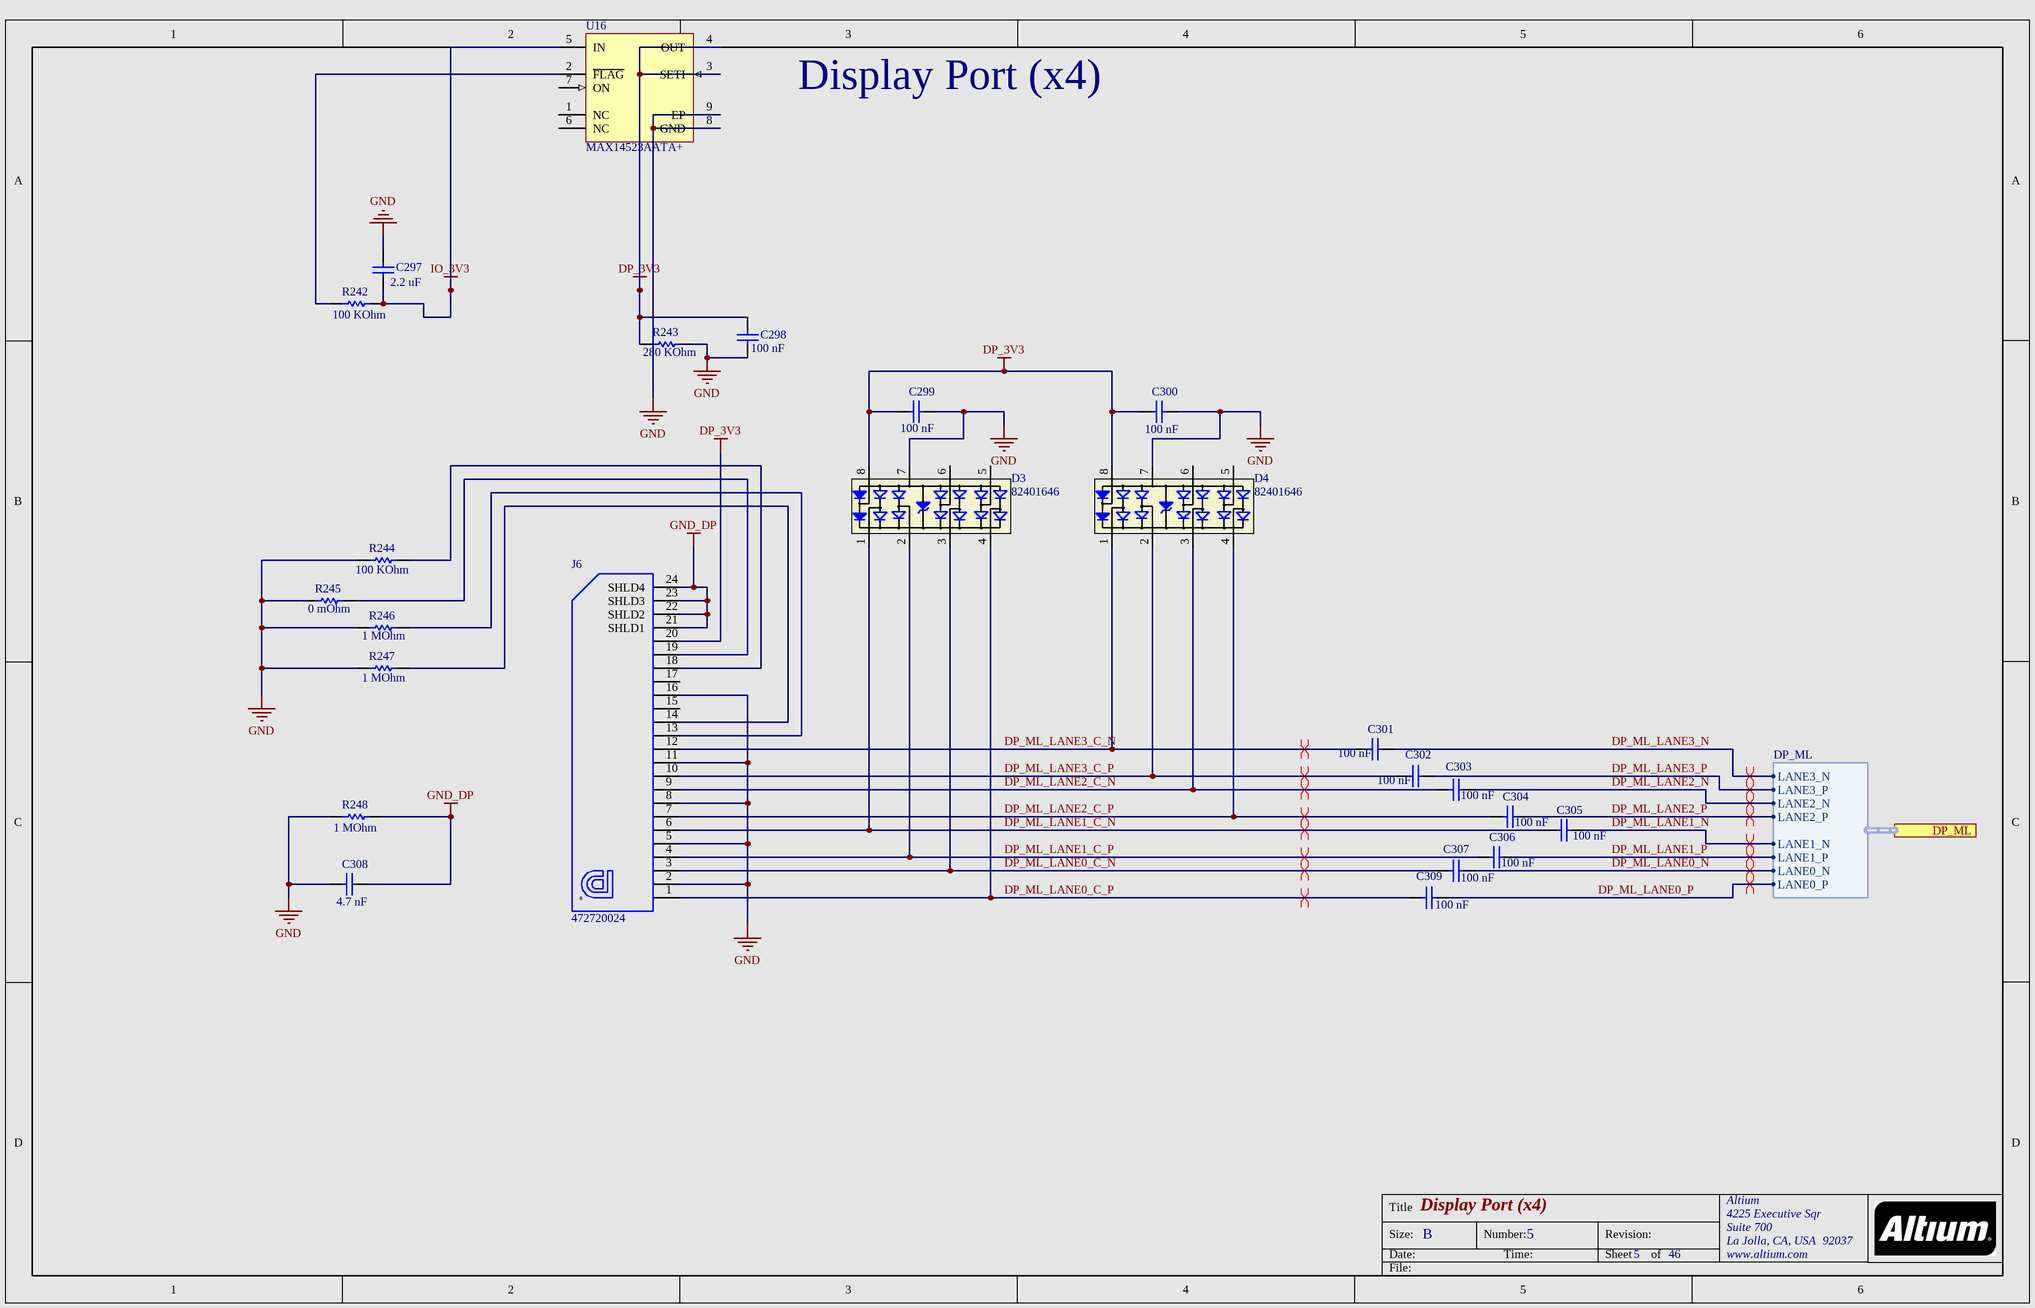
[diagram p2: Display_Port.SchDoc]

### Parts
C297  Capacitance: 2.2 uF  [CAPC1608X90X35ML10T15]  (hidden comment: GRM188R61A225KE34x)
C298  Capacitance: 100 nF  [CAPC1005X55X10LL05]  (hidden comment: C1005X7R1E104M)
C299  Capacitance: 100 nF  [CAPC1005X55X10LL05]  (hidden comment: C1005X7R1E104M)
C300  Capacitance: 100 nF  [CAPC1005X55X10LL05]  (hidden comment: C1005X7R1E104M)
C301  Capacitance: 100 nF  [CAPC1005X55X10LL05]  (hidden comment: C1005X7R1E104M)
C302  Capacitance: 100 nF  [CAPC1005X55X10LL05]  (hidden comment: C1005X7R1E104M)
C303  Capacitance: 100 nF  [CAPC1005X55X10LL05]  (hidden comment: C1005X7R1E104M)
C304  Capacitance: 100 nF  [CAPC1005X55X10LL05]  (hidden comment: C1005X7R1E104M)
C305  Capacitance: 100 nF  [CAPC1005X55X10LL05]  (hidden comment: C1005X7R1E104M)
C306  Capacitance: 100 nF  [CAPC1005X55X10LL05]  (hidden comment: C1005X7R1E104M)
C307  Capacitance: 100 nF  [CAPC1005X55X10LL05]  (hidden comment: C1005X7R1E104M)
C308  Capacitance: 4.7 nF  [CAPC1005X55X25NL05T10]  (hidden comment: GRM155R71H472KA01D)
C309  Capacitance: 100 nF  [CAPC1005X55X10LL05]  (hidden comment: C1005X7R1E104M)
D3  82401646  [MSOP-8L]
D4  82401646  [MSOP-8L]
J6  472720024  [MOLX-472720024_V]
R242  Resistance: 100 KOhm  [RESC1005X40X25LL05T05]  (hidden comment: ERJ-2RKF1003X)
R243  Resistance: 280 KOhm  [RESC1005X40X25LL05T05]  (hidden comment: ERJ-2RKF2803X)
R244  Resistance: 100 KOhm  [RESC1005X40X25LL05T05]  (hidden comment: ERJ-2RKF1003X)
R245  Resistance: 0 mOhm  [RESC1005X40X25ML05T05]  (hidden comment: ERJ-2GE0R00X)
R246  Resistance: 1 MOhm  [RESC1005X40X25LL05T05]  (hidden comment: ERJ-2RKF1004X)
R247  Resistance: 1 MOhm  [RESC1005X40X25LL05T05]  (hidden comment: ERJ-2RKF1004X)
R248  Resistance: 1 MOhm  [RESC1005X40X25LL05T05]  (hidden comment: ERJ-2RKF1004X)
U16  MAX14523AATA+  [MAXM-T833+2_V]

### Ports
DP_ML (harness DP_ML)

### Harnesses
DP_ML: LANE2_P, LANE2_N, LANE3_P, LANE3_N, LANE1_N, LANE1_P, LANE0_N, LANE0_P

### Nets
DP_3V3: C298.2 C299.2 C300.2 D3.8(VDD) D4.8(VDD) J6.20 R243.1 U16.3(SETI) U16.4(OUT)
GND: C297.2 C298.1 C299.1 C300.1 C308.1 D3.7(GND) D4.7(GND) J6.2 J6.5 J6.8 J6.11 J6.16 R243.2 R244.1 R245.1 R246.1 R247.1 R248.1 U16.8(GND) U16.9(EP)
GND_DP: C308.2 J6.21(SHLD1) J6.22(SHLD2) J6.23(SHLD3) J6.24(SHLD4) R248.2
IO_3V3: C297.1 R242.2 U16.5(IN)
DP_ML_LANE0_C_N: C307.2 D3.3(I/O3) J6.3
DP_ML_LANE0_C_P: C309.2 D3.4(I/O4) J6.1
DP_ML_LANE0_N: C307.1 ; port DP_ML.LANE0_N
DP_ML_LANE0_P: C309.1 ; port DP_ML.LANE0_P
DP_ML_LANE1_C_N: C305.2 D3.1(I/O1) J6.6
DP_ML_LANE1_C_P: C306.2 D3.2(I/O2) J6.4
DP_ML_LANE1_N: C305.1 ; port DP_ML.LANE1_N
DP_ML_LANE1_P: C306.1 ; port DP_ML.LANE1_P
DP_ML_LANE2_C_N: C303.2 D4.3(I/O3) J6.9
DP_ML_LANE2_C_P: C304.2 D4.4(I/O4) J6.7
DP_ML_LANE2_N: C303.1 ; port DP_ML.LANE2_N
DP_ML_LANE2_P: C304.1 ; port DP_ML.LANE2_P
DP_ML_LANE3_C_N: C301.2 D4.1(I/O1) J6.12
DP_ML_LANE3_C_P: C302.2 D4.2(I/O2) J6.10
DP_ML_LANE3_N: C301.1 ; port DP_ML.LANE3_N
DP_ML_LANE3_P: C302.1 ; port DP_ML.LANE3_P
NetJ6_13: J6.13 R246.2
NetJ6_14: J6.14 R247.2
NetJ6_18: J6.18 R244.2
NetJ6_19: J6.19 R245.2
NetR242_1: R242.1 U16.2(~{FLAG})

Not connected (* = marked no-connect by the designer): D3 5(I/O5) 6(I/O6); D4 5(I/O5) 6(I/O6); J6 15 17; U16 1(NC) 6(NC) 7(ON)

### Layout directives
differential pair: DP_ML_LANE0_C_N, DP_ML_LANE0_C_P, DP_ML_LANE0_N, DP_ML_LANE0_P, DP_ML_LANE1_C_N, DP_ML_LANE1_C_P, DP_ML_LANE1_N, DP_ML_LANE1_P, DP_ML_LANE2_C_N, DP_ML_LANE2_C_P, DP_ML_LANE2_N, DP_ML_LANE2_P, DP_ML_LANE3_C_N, DP_ML_LANE3_C_P, DP_ML_LANE3_N, DP_ML_LANE3_P

### Notes on the sheet
- Title
- Size:
- Date:
- B
- Number:
- Time:
- Revision:
- Sheet
- of
- File:
- (in symbol CMP-1704-00002-1) ®

### Library data of the parts
C297 = CMP-1662-00016-2: Chip Capacitor, 2.2 uF, +/- 10%, 10 V, -55 to 85 degC, 0603 (1608 Metric), RoHS, Tape and Reel; Tolerance: 10%; Width: 0.031 inch; DatasheetVersion: 01/2013; Case/Package: 0603; Length: 0.063 inch; PartNumber: GRM188R61A225KE34x; Package Quantity: 10000; Case Code (Imperial): 0603; Packaging: Tape and Reel; PackageDescription: 2-Pin Surface Mount Device, Body 1.6 x 0.8 mm; Case Code (Metric): 1608; ComponentLink1Description: Manufacturer URL; Radiation Hardening: No; Mounting Technology: Surface Mount; Height: 0.8 mm; RoHSCompliant: True; ComponentLink2URL: https://datasheet.ciiva.com/134/grm188r61a225ke34-01-134206.pdf; ComponentLink2Description: Datasheet; Max Operating Temperature: 85 degC; Min Operating Temperature: -55 degC; ComponentLink1URL: http://www.murata.com/
C298-C307 C309 = CMP-1663-00009-2: as C283 on sheet DDR4_SODIMM1; Tolerance: 20%; Max Operating Temperature: 125 degC; ComponentLink2URL: http://www.farnell.com/datasheets/1571323.pdf; ComponentLink1URL: http://www.tdk.com/; RoHSCompliant: true; Packaging: Tape and Reel; Mounting Technology: Surface Mount; ComponentLink2Description: Datasheet; Case Code (Imperial): 0402; DatasheetVersion: 09/2011; ComponentLink1Description: Manufacturer URL; PackageDescription: 2-Pin Surface Mount Device, Body 1 x 0.5 mm; PackageReference: 0402; Min Operating Temperature: -55 degC; Case Code (Metric): 1005; Height: 0.5 mm; Package Quantity: 10000; Width: 0.5 mm; Pins: 2; Voltage Rating (DC): 25 V; PartNumber: C1005X7R1E104M; Mount: Surface Mount; Length: 1 mm
C308 = CMP-2008-04663-4: Chip Capacitor, 4.7 nF, +/- 10%, 50 V, -55 to 125 degC, 0402 (1005 Metric), RoHS, Tape and Reel; Manufacturer: Basic Passives; Voltage Rating: 50 V; Case\/Package: 0402; Type (Capacitors): X7R; Case Code (Metric): 1005; Case Code (Imperial): 0402; RoHSCompliant: true; Length: 1 mm; PartNumber: GRM155R71H472KA01D; Width: 0.5 mm; PackageDescription: 2-Pin Surface Mount Device, Body 1 x 0.5 mm; ComponentLink1URL: http://www.murata.com/; Package Quantity: 1; Packaging: Cut Tape; Tolerance: 10%; Height: 0.5 mm; Max Operating Temperature: 125 degC; ComponentLink1Description: Manufacturer URL; Min Operating Temperature: -55 degC; REACH SVHC: No SVHC; Mounting Technology: Surface Mount; ComponentLink2URL: http://search.murata.co.jp/Ceramy/image/img/A01X/G101/ENG/GRM155R71H472KA01-01.pdf; Mount: Surface Mount; Voltage Rating (DC): 50 V; PackageReference: 0402; DatasheetVersion: 02/2016; Radiation Hardening: No; Pins: 2; Lead Pitch: 2 mm; ComponentLink2Description: Datasheet
D3 D4 = CMP-1482-00002-1: TVS Diode WE-TVS-SS, VRWM=5V; Manufacturer: Wuerth Elektronik; Reverse Stand Off Voltage: 5V; ComponentLink1URL: http://www.we-online.com; PartNumber: 82401646; ComponentLink2Description: Datasheet; PackageReference: MSOP-8L; ComponentLink1Description: Manufacturer URL; ComponentLink2URL: http://katalog.we-online.de/kataloge/eisos/media/pdf/82401646.pdf
J6 = CMP-1704-00002-1: DisplayPort Connector, Pitch 0.5 mm, 1 x 20 Position, Height 6.65 mm, -20 to 85 degC, RoHS, Tape and Reel; Manufacturer: Molex; ComponentLink2URL: http://www.molex.com/pdm_docs/sd/472720024_sd.pdf; PackageReference: 472720024; ComponentLink2Description: Datasheet; DatasheetVersion: Rev. F; PackageDescription: DisplayPort Connector, Pitch 0.5 mm, 1 x 20 Position, Height 6.65 mm; ComponentLink1URL: http://www.molex.com/; Mounting Technology: Surface Mount; PartNumber: 472720024; ComponentLink1Description: Manufacturer URL
R242 R244 = CMP-2002-00608-3: Chip Resistor, 100 KOhm, +/- 1%, 100 mW, -55 to 155 degC, 0402 (1005 Metric), RoHS, Tape and Reel; Manufacturer: Basic Passives; Voltage Rating: 50 V; Power Rating: 100 mW; Case\/Package: 0402; Height: 0.35 mm; ComponentLink1Description: Manufacturer URL; Packaging: Tape and Reel; Min Operating Temperature: -55 degC; RoHSCompliant: true; PackageDescription: 2-Pin Surface Mount Device, Body 1 x 0.5 mm; Mount: Surface Mount; Package Quantity: 10000; Max Operating Temperature: 155 degC; ComponentLink1URL: http://www.panasonic.com/; Tolerance: 1%; Mounting Technology: Surface Mount; PartNumber: ERJ-2RKF1003X; Case Code (Metric): 1005; Case Code (Imperial): 0402; REACH SVHC: Yes; Length: 1 mm; Width: 0.5 mm; DatasheetVersion: 04/2015; Pins: 2; ComponentLink2Description: Datasheet; ComponentLink2URL: http://industrial.panasonic.com/cdbs/www-data/pdf/RDA0000/AOA0000C86.pdf; PackageReference: 0402; Radiation Hardening: No
R243 = CMP-2002-00835-3: Chip Resistor, 280 KOhm, +/- 1%, 100 mW, -55 to 155 degC, 0402 (1005 Metric), RoHS, Cut Tape; Manufacturer: Basic Passives; Power Rating: 100 mW; Voltage Rating: 50 V; Case\/Package: 0402; Mount: Surface Mount; Width: 0.02 inch; Max Operating Temperature: 155 degC; REACH SVHC: Yes; Min Operating Temperature: -55 degC; PartNumber: ERJ-2RKF2803X; Mounting Technology: Surface Mount; ComponentLink1URL: http://www.panasonic.com/; Packaging: Cut Tape; Case Code (Imperial): 0402; ComponentLink1Description: Manufacturer URL; Tolerance: 1%; PackageDescription: 2-Pin Surface Mount Device, Body 1 x 0.5 mm; Package Quantity: 10000; Height: 0.016 inch; Length: 0.039 inch; Case Code (Metric): 1005; RoHSCompliant: true; ComponentLink2Description: Datasheet; PackageReference: 0402; ComponentLink2URL: http://industrial.panasonic.com/cdbs/www-data/pdf/RDA0000/AOA0000C86.pdf; Pins: 2; DatasheetVersion: 04/2015
R245 = CMP-2002-00429-3: Chip Resistor, 0 mOhm, +/- 5%, 100 mW, -55 to 155 degC, 0402 (1005 Metric), RoHS, Tape and Reel; Manufacturer: Basic Passives; Power Rating: 100 mW; Voltage Rating: 50 V; Case\/Package: 0402; Max Operating Temperature: 155 degC; Tolerance: 5%; PartNumber: ERJ-2GE0R00X; Case Code (Imperial): 0402; Package Quantity: 10000; Length: 1 mm; Mounting Technology: Surface Mount; ComponentLink1URL: http://www.panasonic.com/; Height: 0.35 mm; Width: 0.5 mm; Min Operating Temperature: -55 degC; Case Code (Metric): 1005; RoHSCompliant: true; REACH SVHC: Unknown; ComponentLink1Description: Manufacturer URL; Packaging: Tape and Reel; Mount: Surface Mount; PackageDescription: 2-Pin Surface Mount Device, Body 1 x 0.5 mm; PackageReference: 0402; ComponentLink2URL: http://industrial.panasonic.com/cdbs/www-data/pdf/RDA0000/AOA0000C84.pdf; DatasheetVersion: 03/2015; Radiation Hardening: No; Pins: 2; ComponentLink2Description: Datasheet
R246-R248 = CMP-2002-00609-3: Chip Resistor, 1 MOhm, +/- 1%, 100 mW, -55 to 155 degC, 0402 (1005 Metric), RoHS, Tape and Reel; Manufacturer: Basic Passives; Power Rating: 100 mW; Voltage Rating: 50 V; Case\/Package: 0402; Mount: Surface Mount; PartNumber: ERJ-2RKF1004X; Height: 0.35 mm; PackageDescription: 2-Pin Surface Mount Device, Body 1 x 0.5 mm; Max Operating Temperature: 155 degC; Mounting Technology: Surface Mount; Case Code (Metric): 1005; REACH SVHC: Yes; Length: 1 mm; ComponentLink1URL: http://www.panasonic.com/; Min Operating Temperature: -55 degC; Width: 0.5 mm; Tolerance: 1%; Package Quantity: 10000; ComponentLink1Description: Manufacturer URL; RoHSCompliant: true; Packaging: Tape and Reel; Case Code (Imperial): 0402; Pins: 2; ComponentLink2URL: http://industrial.panasonic.com/cdbs/www-data/pdf/RDA0000/AOA0000C86.pdf; Weight: 2.8E-05oz; Radiation Hardening: No; ComponentLink2Description: Datasheet; DatasheetVersion: 04/2015; PackageReference: 0402
U16 = CMP-0247-00012-3: Adjustable Current-Limit Switch, 1.7 to 5.5 V, -40 to 125 degC, 8-Pin TDFN (T833+2), RoHS; Manufacturer: Maxim; ILIM: 0.25 to 1.5 A; RON: 70 mOhm Typ.; IQ: 170 uA Typ.; VIH: 1.6 V Min.; VIL: 0.4 V Max.; PartNumber: MAX14523AATA+; Operating Temperature: -40 to 125 degC; Mounting Technology: Surface Mount; VIN: 1.7 to 5.5 V; ComponentLink3Description: Package Specification; ComponentLink2URL: http://datasheets.maximintegrated.com/en/ds/MAX14523A-MAX14523C.pdf; PackageVersion: Mar-14; ComponentLink1URL: http://www.maximintegrated.com/; ComponentLink3URL: http://pdfserv.maximintegrated.com/package_dwgs/21-0137.PDF; ComponentLink1Description: Manufacturer URL; RoHS: TRUE; PackageDescription: 8-Pin SON, Body 3 x 3 mm, Pitch 0.65 mm; ComponentLink2Description: Datasheet; DatasheetVersion: Rev. 1